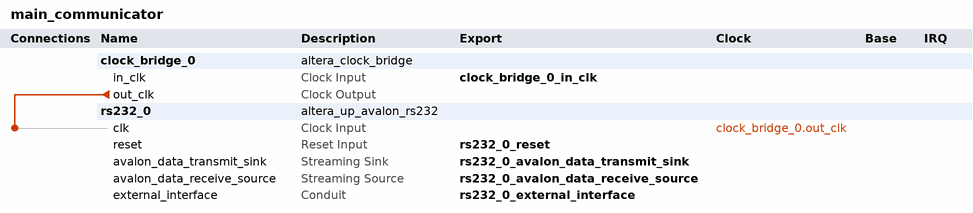
[diagram p0: system contents]
# Platform Designer (Qsys) system main_communicator, Cyclone IV E EP4CE115F29C8L
# Parameters at their usual value, and those the tool derives, are not listed.
package require -exact qsys 24.1
create_system main_communicator
set_project_property DEVICE_FAMILY {Cyclone IV E}
set_project_property DEVICE EP4CE115F29C8L

add_instance clock_bridge_0 altera_clock_bridge 24.1
set_instance_parameter_value clock_bridge_0 DERIVED_CLOCK_RATE 0
set_instance_parameter_value clock_bridge_0 EXPLICIT_CLOCK_RATE 50000000

add_instance rs232_0 altera_up_avalon_rs232 17.1
set_instance_property rs232_0 AUTO_EXPORT true
set_instance_parameter_value rs232_0 avalon_bus_type Streaming
set_instance_parameter_value rs232_0 baud 115200
set_instance_parameter_value rs232_0 parity None

# connections
add_connection clock_bridge_0.out_clk rs232_0.clk clock

# exported interfaces
add_interface clock_bridge_0_in_clk clock sink
set_interface_property clock_bridge_0_in_clk EXPORT_OF clock_bridge_0.in_clk
add_interface rs232_0_avalon_data_receive_source avalon_streaming source
set_interface_property rs232_0_avalon_data_receive_source EXPORT_OF rs232_0.avalon_data_receive_source
add_interface rs232_0_avalon_data_transmit_sink avalon_streaming sink
set_interface_property rs232_0_avalon_data_transmit_sink EXPORT_OF rs232_0.avalon_data_transmit_sink
add_interface rs232_0_external_interface conduit end
set_interface_property rs232_0_external_interface EXPORT_OF rs232_0.external_interface
add_interface rs232_0_reset reset sink
set_interface_property rs232_0_reset EXPORT_OF rs232_0.reset

set_interconnect_requirement {$system} qsys_mm.clockCrossingAdapter HANDSHAKE
set_interconnect_requirement {$system} qsys_mm.enableEccProtection FALSE
set_interconnect_requirement {$system} qsys_mm.insertDefaultSlave FALSE
set_interconnect_requirement {$system} qsys_mm.maxAdditionalLatency 1

save_system main_communicator.qsys
